# Altium schematic sheet USB_C2.SchDoc
size A4; SheetNumber: 5; SheetTotal: 8
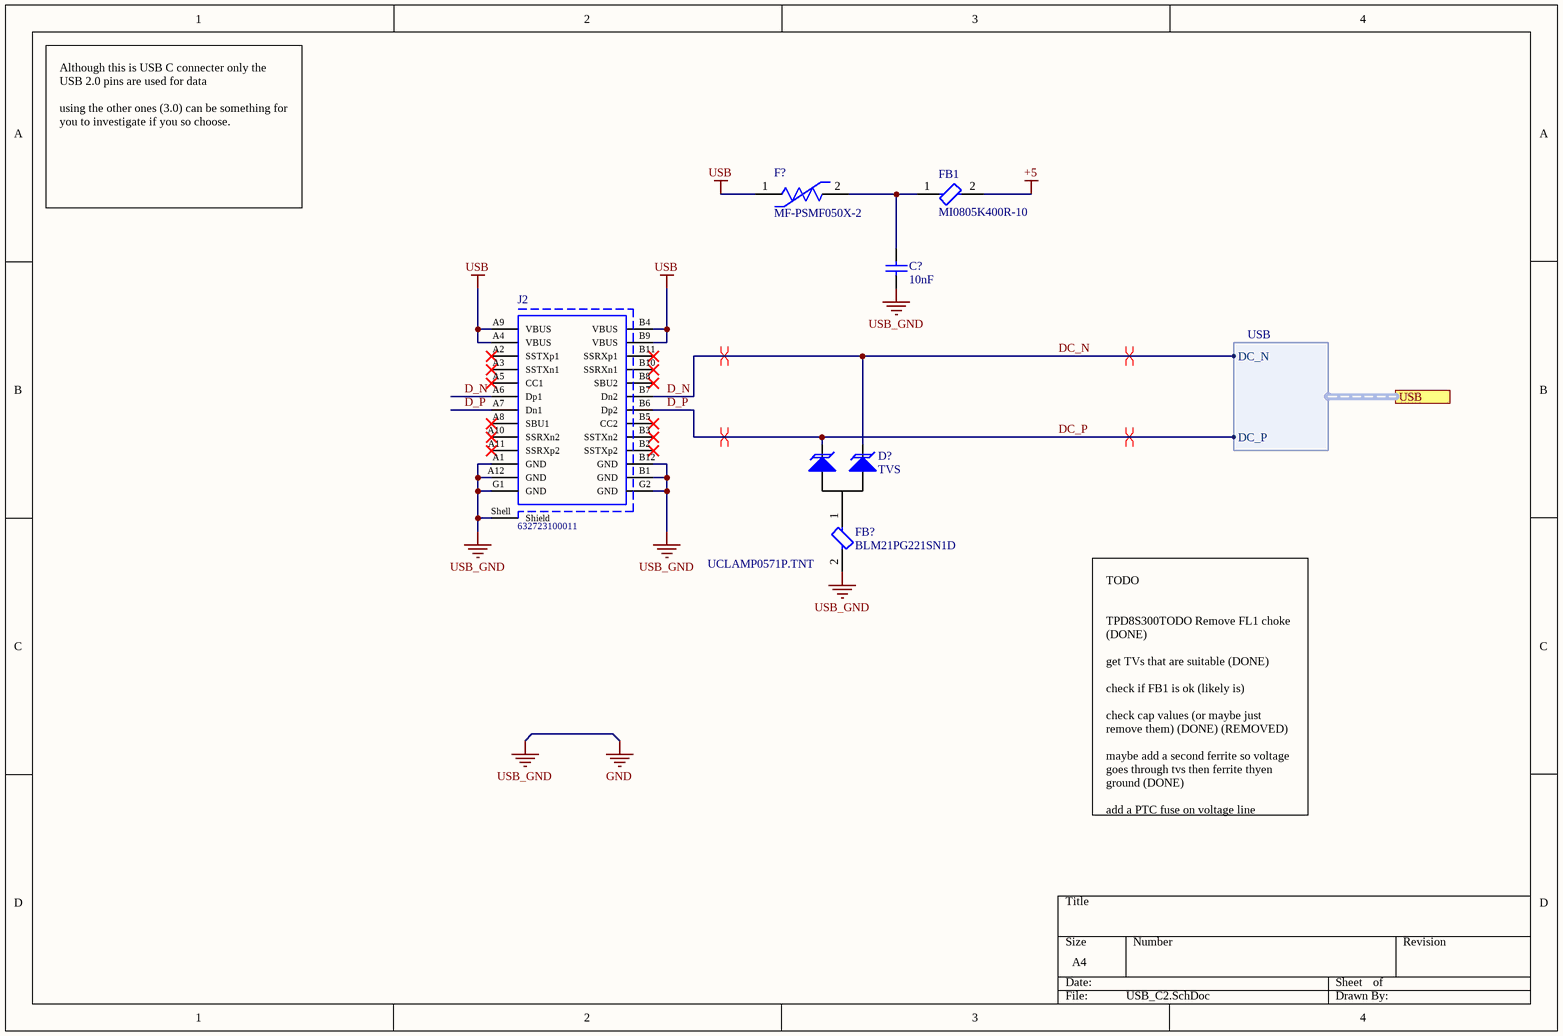
[diagram p0: USB_C2.SchDoc]

## Parts
C?  10nF
D?  TVS  [SOT50P160X90-3N]
F?  MF-PSMF050X-2  [FP-MF-PSMF-MFG]
FB1  MI0805K400R-10  [FP-MI0805-MFG]
FB?  BLM21PG221SN1D  [FP-BLM21-0_2-t0_85-e0_5-IPC_B]
J2  632723100011  [632723100011]

## Ports
USB (harness USB)

## Harnesses
USB: DC_N, DC_P

## Nets
+5: FB1.2
GND: C?.1 FB?.2 J2.A1(GND) J2.A12(GND) J2.B1(GND) J2.B12(GND) J2.G1(GND) J2.G2(GND) J2.Shell(Shield)  [also labelled USB_GND]
USB: F?.1 J2.A4(VBUS) J2.A9(VBUS) J2.B4(VBUS) J2.B9(VBUS)
D_N: D?.1 J2.A6(Dp1) J2.B7(Dn2) ; port USB.DC_N  [also labelled DC_N]
D_P: D?.2 J2.A7(Dn1) J2.B6(Dp2) ; port USB.DC_P  [also labelled DC_P]
NetC?_2: C?.2 F?.2 FB1.1
NetD?_3: D?.3 FB?.1

Not connected (* = marked no-connect by the designer): J2 A2(SSTXp1)* A3(SSTXn1)* A5(CC1)* A8(SBU1)* A10(SSRXn2)* A11(SSRXp2)* B2(SSTXp2)* B3(SSTXn2)* B5(CC2)* B8(SBU2)* B10(SSRXn1)* B11(SSRXp1)*

## Layout directives
differential pair: D_N, D_P

## Notes on the sheet
- Although this is USB C connecter only the USB 2.0 pins are used for data
  using the other ones (3.0) can be something for you to investigate if you so choose.
- UCLAMP0571P.TNT
- TODO
  TPD8S300TODO Remove FL1 choke (DONE)
  get TVs that are suitable (DONE)
  check if FB1 is ok (likely is)
  check cap values (or maybe just remove them) (DONE) (REMOVED)
  maybe add a second ferrite so voltage goes through tvs then ferrite thyen ground (DONE)
  add a PTC fuse on voltage line (DONE)

## Library data of the parts
C? = 10nF: 10nF ceramic Capacitor / (USB 5V smoothing cap); Published: 8-Jun-2000; LatestRevisionDate: 17-Jul-2002; LatestRevisionNote: Re-released for DXP Platform.; PackageReference: RAD-0.3; Publisher: Altium Limited; PackageDescription: Radial Cap, Thru-Hole; 2 Leads; 0.3 in Pin Spacing
D? = TVS combined: dual TVS diode for USB 2.0 protection / RCLAMP0582BQTCT; Supplier 1: Digi-Key; Supplier 2: Digi-Key; Supplier 3: Digi-Key; Supplier 4: Mouser; Supplier Part Number 1: RCLAMP0582BQTCTCT-ND; Supplier Part Number 2: RCLAMP0582BQTCTDKR-ND; Supplier Part Number 3: RCLAMP0582BQTCTTR-ND; Supplier Part Number 4: 947-RCLAMP0582BQTCT
F? = CMP-07400-000013-1: PTC RESET FUSE 6V 500MA 0805; Manufacturer: Bourns Inc.; Trip Current: 1A; Trip Time: 0.1s; Value: 0.15-0.9Ω; Hold Current: 0.5A; Current Rating: 40A; Category: Fuse; Temperature: -40°C to +85°C; ComponentLink2Description: Datasheet; Manufacturer Part Number: MF-PSMF050X-2; Temperature Range High: +85°C; Package: MF-PSMF; Device Class L1: Circuit Protection; Lead Free: Yes; ComponentLink2URL: https://www.bourns.com/docs/product-datasheets/mfpsmf.pdf?sfvrsn=9c05cafe_24; Ambient Temperature Range Low: -40°C; Mouser Description: Resettable Fuses - PPTC .50A 6V 0.15ohm Hold .5 Trip 1; Resistance: 0.15-0.9Ω; Automotive: Yes; Ambient Temperature Range High: +85°C; Device Class L2: PTC Resettable Fuses; Temperature Range Low: -40°C; Device Class L3: unset; Octopart: https://octopart.com/mf-psmf050x-2-bourns-7483438; Digikey Description: PTC RESET FUSE 6V 500MA 0805; Height: 0.85mm; RoHS: TRUE; Voltage Rating: 6V
FB1 = CMP-2000-06702-2: FERRITE BEAD 40 OHM 0805 1LN; Impedance: 40R; Max Current Rating: 1.5A; Tolerance: 25%; Test Frequency: 100MHz; DC Resistance (DCR): 50mR; Number of Lines: 1; Min Operating Temperature: -40°C; Case/Package: 0805; Depth: 1.45mm; Current Rating: 1.5A; Width: 0.049inch; Core Material: Ferrite; Termination: SMD/SMT; Case Code (Imperial): 0805; Packaging: Tape and Reel; Weight: 0.00392oz; Lead Free: Lead Free; Length: 2mm; Max Operating Temperature: 125°C; Mount: Surface Mount; Case Code (Metric): 2012; Frequency: 100MHz; Height: 0.043inch; Package Quantity: 1; Material: Ferrite; Contact Plating: Tin; Max DC Current: 1.5A
FB? = CMP-0686-00610-3: Chip Ferrite Bead, 0805, 220Ω @ 100MHz, 0.045Ω, 25%, 2A; Number of Circuits: 1; Shielding: Unshielded; DC Resistance (DCR): 45mR; Impedance: 220R; Radiation Hardening: No; Material: Ferrite; Frequency: 100MHz; Width: 1.25mm; DC Current: 2A; Max DC Current: 2A; Number of Lines: 1; Package Quantity: 1; Case Code (Metric): 2012; Current Rating: 2A; Case/Package: 0805; Current: 2A; Military Standard: Not; Core Material: Ferrite; Depth: 1.25mm; Contact Plating: Tin; DC Resistance-Max: 45mR; Max Operating Temperature: 125°C; Length: 2mm; Max Current Rating: 2A; REACH SVHC: No SVHC; Termination: SMD/SMT; Min Operating Temperature: -55°C; Series: BLM21P; Test Frequency: 100MHz; Tolerance: 25%; Number of Pins: 2; RoHS Compliant: Yes; Height: 0.85mm; Packaging: Tape and Reel; Lead Free: Lead Free; Case Code (Imperial): 0805
J2 = CMP-1502-03213-1: USB 3.1 Type C Receptacle WR-COM, Horizontal, SMT / THT; Manufacturer: Wurth Elektronik; Working Voltage: 20VDC; Rated Current: 5A; Contact Resistance: 30mOhm; Operating Temperature: -40to105degC; Publisher: WurthElektronik; Gender: Receptacle; Part Number: 632723100011; Mounting Technology: SMT/THT; Datasheet URL: https://katalog.we-online.de/em/datasheet/632723x00011%282%29.pdf; Connector Type: USB3.1TypeC; Manufacturer URL: http://www.we-online.de; Orientation: Horizontal; Package Reference: 632723100011; Packaging: TapeandReel